# EAGLE design rc4 (EAGLE 9.6.2)
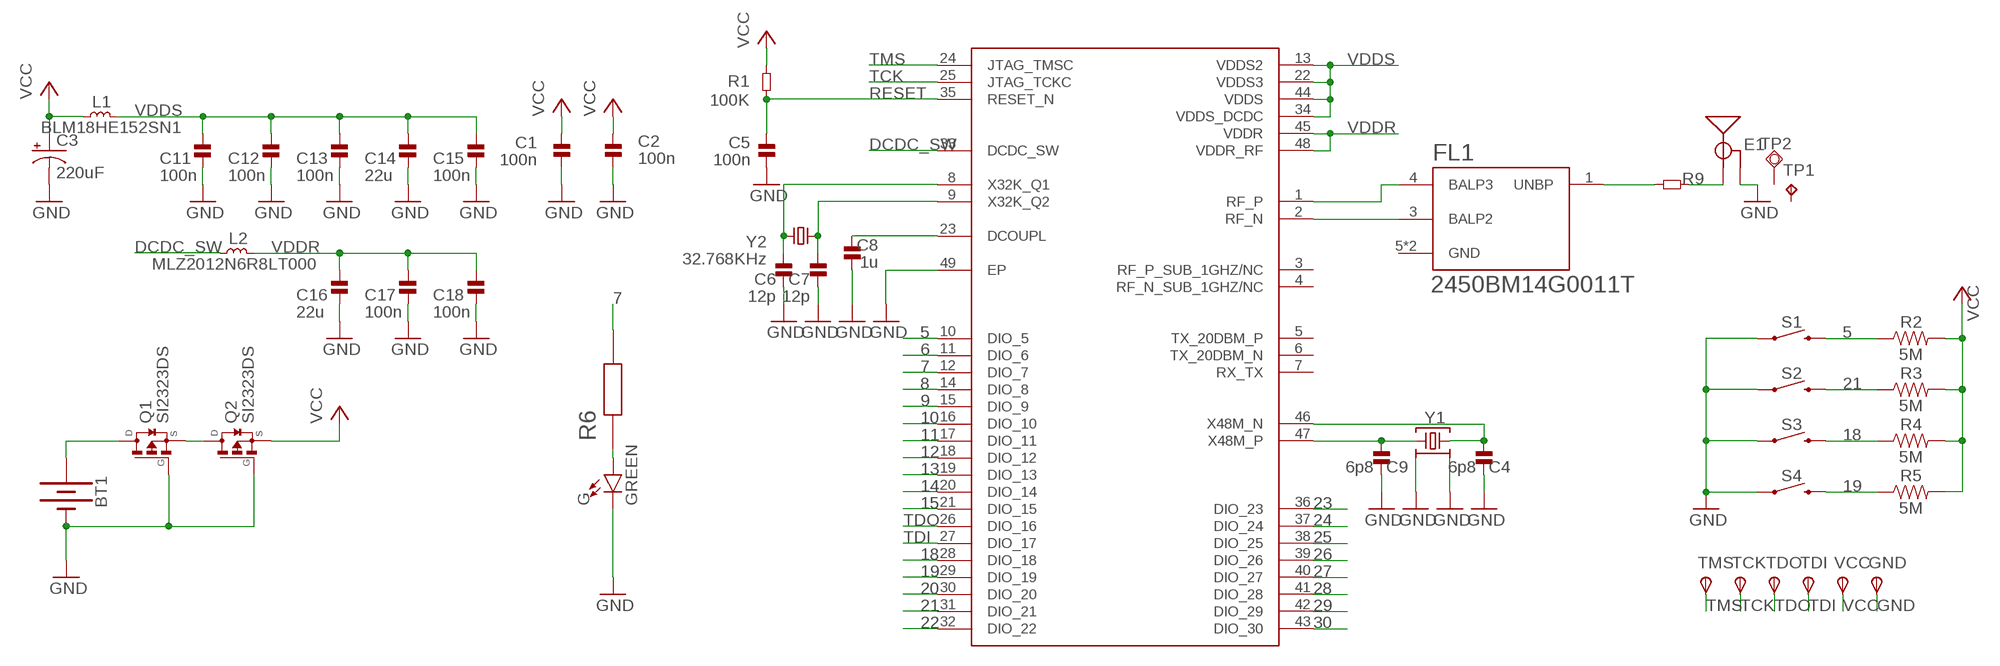
[diagram p0: schematic, sheet 1]

## Parts
BT1  BATTERY-20MM_SMD_4LEGS_OVERPASTE  [BATTCON_20MM_4LEGS_OVERPASTE]
C1  100n  CAP-0402  [_PKG_C_0402]
C2  100n  CAP-0402  [_PKG_C_0402]
C3  220uF  47UF-POLAR-EIA3528-10V-10%  [EIA3528]
C4  6p8  CAP-0402  [_PKG_C_0402]
C5  100n  CAP-0402  [_PKG_C_0402]
C6  12p  CAP-0402  [_PKG_C_0402]
C7  12p  CAP-0402  [_PKG_C_0402]
C8  1u  CAP-0402  [_PKG_C_0402]
C9  6p8  CAP-0402  [_PKG_C_0402]
C11  100n  CAP-0402  [_PKG_C_0402]
C12  100n  CAP-0402  [_PKG_C_0402]
C13  100n  CAP-0402  [_PKG_C_0402]
C14  22u  CAP-0805  [_PKG_C_0805]
C15  100n  CAP-0402  [_PKG_C_0402]
C16  22u  CAP-0805  [_PKG_C_0805]
C17  100n  CAP-0402  [_PKG_C_0402]
C18  100n  CAP-0402  [_PKG_C_0402]
E1  ANTENNA-GROUNDEDTRACE-15.2MM  [TRACE_ANTENNA_2.4GHZ_15.2MM]
FL1  2450BM14G0011T  [BALUN_2450BM14G0011T]
G  GREEN  LED-GREEN0603  [LED-0603]
GND  TPSTP11R  [TP11R]
IC3  CC2652R1FRGZ  CC2652P1FRGZRRGZ0048A-IPC_B  [RGZ0048A-IPC_B]
L1  BLM18HE152SN1  INDUCTOR-0603  [_PKG_L_0603]
L2  MLZ2012N6R8LT000  INDUCTOR-0805  [_PKG_C_0805]
Q1  SI2323DS  [SOT23]
Q2  SI2323DS  [SOT23]
R1  100K  RES-0402  [_PKG_C_0402]
R2  5M  2.49KOHM-0603-1/10W-1%  [0603]
R3  5M  2.49KOHM-0603-1/10W-1%  [0603]
R4  5M  2.49KOHM-0603-1/10W-1%  [0603]
R5  5M  2.49KOHM-0603-1/10W-1%  [0603]
R6  2.2k  RES0402  [RESC1005X40N]
R9  0  RES-0402  [_PKG_C_0402]
S1  MOMENTARY-SWITCH-SPST-SMD-5.2MM  [TACTILE_SWITCH_SMD_5.2MM]
S2  MOMENTARY-SWITCH-SPST-SMD-5.2MM  [TACTILE_SWITCH_SMD_5.2MM]
S3  MOMENTARY-SWITCH-SPST-SMD-5.2MM  [TACTILE_SWITCH_SMD_5.2MM]
S4  MOMENTARY-SWITCH-SPST-SMD-5.2MM  [TACTILE_SWITCH_SMD_5.2MM]
TCK  TPSTP11R  [TP11R]
TDI  TPSTP11R  [TP11R]
TDO  TPSTP11R  [TP11R]
TMS  TPSTP11R  [TP11R]
TP1  TPTP06SQ  [TP05SQ]
TP2  TPSQTP15SQ  [TP15SQ]
VCC  TPSTP11R  [TP11R]
Y1  Q22FA12800150  48.000MHZ_CX2016DB48000C0FPLC1  [XTAL-4P-2016]
Y2  32.768KHz  32.768KHZ_Q13FC1350000400  [XTAL-2P-3215]

## Nets
5: IC3.10(DIO_5) R2.1 S1.3
6: IC3.11(DIO_6)
7: IC3.12(DIO_7) R6.2
8: IC3.14(DIO_8)
9: IC3.15(DIO_9)
10: IC3.16(DIO_10)
11: IC3.17(DIO_11)
12: IC3.18(DIO_12)
13: IC3.19(DIO_13)
14: IC3.20(DIO_14)
15: IC3.21(DIO_15)
18: IC3.28(DIO_18) R4.1 S3.3
19: IC3.29(DIO_19) R5.1 S4.3
20: IC3.30(DIO_20)
21: IC3.31(DIO_21) R3.1 S2.3
22: IC3.32(DIO_22)
23: IC3.36(DIO_23)
24: IC3.37(DIO_24)
25: IC3.38(DIO_25)
26: IC3.39(DIO_26)
27: IC3.40(DIO_27)
28: IC3.41(DIO_28)
29: IC3.42(DIO_29)
30: IC3.43(DIO_30)
DCDC_SW: IC3.33(DCDC_SW) L2.1
DCOUPL: C8.2 IC3.23(DCOUPL)
GND: BT1.2(-) C1.1 C2.1 C3.C(-) C4.1 C5.1 C6.1 C7.1 C8.1 C9.1 C11.2 C12.2 C13.2 C14.2 C15.2 C16.2 C17.2 C18.2 E1.GND G.C GND.TP(PP) IC3.49(EP) Q1.1(G) Q2.1(G) S1.1 S2.1 S3.1 S4.1 Y1.2 Y1.4
N$1: FL1.4(BALP3) IC3.1(RF_P)
N$2: FL1.3(BALP2) IC3.2(RF_N)
N$3: FL1.1(UNBP) R9.2
N$4: C4.2 IC3.46(X48M_N) Y1.3
N$5: E1.ANT(SIGNAL) R9.1
N$6: BT1.1(+) Q1.3(D)
N$11: G.A R6.1
N$15: Q1.2(S) Q2.3(D)
N$21: C9.2 IC3.47(X48M_P) Y1.1
RESET: C5.2 IC3.35(RESET_N) R1.1
TCK: IC3.25(JTAG_TCKC) TCK.TP(PP)
TDI: IC3.27(DIO_17) TDI.TP(PP)
TDO: IC3.26(DIO_16) TDO.TP(PP)
TMS: IC3.24(JTAG_TMSC) TMS.TP(PP)
VCC: C1.2 C2.2 C3.A(+) L1.1 Q2.2(S) R1.2 R2.2 R3.2 R4.2 R5.2 VCC.TP(PP)
VDDR: C16.1 C17.1 C18.1 IC3.45(VDDR) IC3.48(VDDR_RF) L2.2
VDDS: C11.1 C12.1 C13.1 C14.1 C15.1 IC3.13(VDDS2) IC3.22(VDDS3) IC3.34(VDDS_DCDC) IC3.44(VDDS) L1.2
X32K_Q1: C6.2 IC3.8(X32K_Q1) Y2.1
X32K_Q2: C7.2 IC3.9(X32K_Q2) Y2.2
Unconnected: IC3.3(RF_P_SUB_1GHZ/NC) IC3.4(RF_N_SUB_1GHZ/NC) IC3.5(TX_20DBM_P) IC3.6(TX_20DBM_N) IC3.7(RX_TX) TP1.TP TP2.TP

## Power pins joined to a net without a drawn wire
GND: FL1.5(GND) FL1.6(GND)

## Library data of the parts
BT1 = Batteries:BATTERY: Battery - Single Cell A variety of battery chemistries, sizes, and footprints. Device List: 20MM_PTH - Coin Cell Battery Holder - 20mm (PTH) <https://www.sparkfun.com/products/783> 6.8MM_PTH - Coin Cell Battery Holder - 6.8MM(SMD) <https://www.digikey.com/product-detail/en/seiko-instruments/MS621FE-FL11E/728-1057-ND/1889208?WT.srch=1&gclid=CNOQ5a6LzdQCFZS2wAodXCkE0g> 12MM_SMD - Coin Cell Battery Holder - 12mm (SMD) <https://www.sparkfun.com/products/10592> 12MM_PTH - Coin Cell Battery Holder - 12mm (PTH) <https://www.sparkfun.com/products/7948> 20MM_SMD - 20mm Coin Cell Battery Holder (SMD) (2 legs) Used on the Big Time Watch Kit <https://www.sparkfun.com/products/11734> 20MM_SMD_4LEGS - Coin Cell Battery Holder - 20mm (SMD) <https://www.sparkfun.com/products/11892> 20MM_SMD_4LEGS_OVERPASTE - Coin Cell Battery Holder - 20mm (SMD) <https://www.sparkfun.com/products/11892> (Over-paste on the legs) 24.5MM_PTH - Coin Cell Battery Holder - 24.5mm (PTH) <https://www.sparkfun.com/products/8863> 9V - 9V Battery Holder - PC Mount Used on the SparkFun SparkPunk Sound Kit <https://www.sparkfun.com/products/11177> and SparkFun SparkPunk Sequencer Kit <https://www.sparkfun.com/products/12707> 18650 - Battery Holder - 18650 (PTH) <https://www.sparkfun.com/products/13113> AA - Battery Holder - 1xAA (PTH) <https://www.sparkfun.com/products/7949> AAA - Battery Holder - 1xAAA (PTH) <https://www.sparkfun.com/products/12718> AA_KIT - Battery Holder - 1xAA (PTH) <https://www.sparkfun.com/products/7949> Special kit package - pads only have exposed copper on one side of the board. AAA_KIT - Battery Holder - 1xAAA (PTH) <https://www.sparkfun.com/products/12718> Special kit package - pads only have exposed copper on one side of the board.; PROD_ID: PRT-11892; SF_SKU: BATT-10373
C1 C2 C4-C9 C11-C18 = ok-discretes-dev:CAP
C3 = SparkFun-Capacitors:47UF-POLAR: 47µF polarized capacitors A capacitor is a passive two-terminal electrical component used to store electrical energy temporarily in an electric field.; PROD_ID: CAP-08310; VALUE: 47uF
E1 = SparkFun-RF2:ANTENNA-GROUNDED: Antenna w/ Ground Connection 2.4GHz antennae with signal and ground terminals. TRACE_ANTENNA_2.4GHZ_15.2MM - Meander Trace antenna 15.2 x 5.7mm footprint Based on layout from TI app note AN043 <http://www.ti.com/lit/an/swra117d/swra117d.pdf>. TRACE_ANTENNA_2.4GHZ_25.7MM - Inverted F trace antenna 25.7 x 7.5 mm footprint. Based on layout from TI design note DN0007 <http://www.ti.com/lit/an/swru120b/swru120b.pdf>.
FL1 = 2450BM14G0011T:2450BM14G0011T: BALUN-BPF TI CC2640 CC2650 MATCH Check availability <https://pricing.snapeda.com/parts/2450BM14G0011T/Johanson%20Technology/view-part?ref=eda>; AVAILABILITY: In Stock; DESCRIPTION: RF Balun 2.4GHz ~ 2.5GHz 50 / -Ohm 0603 (1608 Metric), 6 PC Pad; MF: Johanson Technology; MP: 2450BM14G0011T; PACKAGE: 0603 Johanson; PRICE: None; PURCHASE-URL: https://pricing.snapeda.com/search/part/2450BM14G0011T/?ref=eda
G = SparkFun-LED:LED-GREEN: Green SMD LED Used in manufacturing of various products at SparkFun Packages: 0603 - SMD 0603 package [Product Link] <http://www.futureelectronics.com/en/technologies/semiconductors/optoelectronics/leds/Pages/9894312-LTST-C190GKT.aspx?CrossPart=HSMG-C190&IM=0> LilyPad 1206 - SMD1206 LilyPad package [Product Link] <http://www.futureelectronics.com/en/Technologies/Product.aspx?ProductID=IN150NGHARVATEKCORPORATION2049943&IM=0> 1206 - SMD1206 package [Product Link] <http://www.futureelectronics.com/en/technologies/semiconductors/optoelectronics/leds/Pages/8315665-LTST-C150KGKT.aspx?IM=0> 1206 Bottom Mount -SMD 1206 Bottom Mount [Product Link] <http://www.digikey.com/product-detail/en/lite-on-inc/LTST-C230KGKT/160-1456-1-ND/386854> SparkFun Products: Pro Mini 328 -5V <https://www.sparkfun.com/products/821> RedBoard <https://www.sparkfun.com/products/12757> MP3 Trigger <https://www.sparkfun.com/products/13720> Makey Makey <https://www.sparkfun.com/products/11076>; PROD_ID: DIO-00821
GND TCK TDI TDO TMS VCC = testpad:TPS: TEST PIN
IC3 = CC2652P1FRGZR:CC2652P1FRGZR; COPYRIGHT: Copyright (C) 2022 Ultra Librarian. All rights reserved.; MANUFACTURER_PART_NUMBER: CC2652P1FRGZR; MFR_NAME: Texas Instruments; REFDES: RefDes; TYPE: TYPE
L1 L2 = ok-discretes-dev:INDUCTOR
Q1 Q2 = SI2323DS:SI2323DS: P-Channel MOSFET; AVAILABILITY: Unavailable; DESCRIPTION: P-Channel 20V 3.7A (Ta) 750mW (Ta) Surface Mount SOT-23-3 (TO-236); MF: Vishay Siliconix; MP: SI2323DS; PACKAGE: SOT-23-3 Vishay Siliconix; PRICE: None
R1 R9 = ok-discretes-dev:RES
R2-R5 = SparkFun-Resistors:2.49KOHM: 2.49kΩ resistor A resistor is a passive two-terminal electrical component that implements electrical resistance as a circuit element. Resistors act to reduce current flow, and, at the same time, act to lower voltage levels within circuits. - Wikipedia; PROD_ID: RES-09568; VALUE: 2.49k
R6 = discretes-dev:RES0402: RESISTOR, 0402 0.063W 1% 3M6; Resistance:3.6Mohm; Resistance Tolerance:± 1%; Power Rating:0.063W; Voltage Rating:50V; Series:RC32H; Temperature Coefficient:± 100ppm/°C; Resistor Element Type:Thick Film; Resistor Case Style:0402; No. of Pins:2; SVHC:No SVHC; Case Style:0402; External Length / Height:1mm; Temperature Coeff. +:100ppm/°C; Temperature Coeff. -:100ppm/°C; External Depth:0.35mm; External Width:0.5mm; Operating Temperature Range:-55°C to +155°C; Overload Voltage:100V Check prices <https://pricing.snapeda.com/parts/RC0402FR-073M6L/Yageo/view-part?ref=eda>; AVAILABILITY: Good; DESCRIPTION: RESISTOR, 0402 0.063W 1% 3M6; Resistance:3.6Mohm; Resistance Tolerance:± 1%; Power Rating:0.063W; Voltage Rating:50V; Series:RC32H; Temperature Coefficient:± 100ppm/°C; Resistor Element Type:Thick Film; Resistor Case Style:0402; No. of Pins:2; SVHC:No SVHC; Case Style:0402; External Length / Height:1mm; Temperature Coeff. +:100ppm/°C; Temperature Coeff. -:100ppm/°C; External Depth:0.35mm; External Width:0.5mm; Operating Temperature Range:-55°C to +155°C; Overload Voltage:100V; MF: Yageo; MP: RC0402FR-073M6L; PACKAGE: 1005 Panasonic Electronic Components; PRICE: None; PURCHASE-URL: https://pricing.snapeda.com/search/part/RC0402FR-073M6L/?ref=eda
S1-S4 = SparkFun-Switches:MOMENTARY-SWITCH-SPST: Momentary Switch (Pushbutton) - SPST Normally-open (NO) SPST momentary switches (buttons, pushbuttons). Variants PTH-12MM - 12mm square, through-hole Momentary Pushbutton Switch - 12mm Square <https://www.sparkfun.com/products/9190> (COM-09190) PTH-6.0MM, PTH-6.0MM-KIT - 6.0mm square, through-hole Mini Pushbutton Switch <https://www.sparkfun.com/products/97> (COM-00097) KIT package intended for soldering kit's - only one side of pads' copper is exposed. PTH-RIGHT-ANGLE-KIT - Right-angle, through-hole Right Angle Tactile Button <https://www.sparkfun.com/products/10791> - Used on SparkFun BigTime Watch Kit <https://www.sparkfun.com/products/11734> SMD-12MM - 12mm square, surface-mount Tactile Button - SMD (12mm) <https://www.sparkfun.com/products/12993> (COM-12993) Used on SparkFun PicoBoard <https://www.sparkfun.com/products/11888> SMD-4.5MM - 4.5mm Square Trackball Switch Used on SparkFun Blackberry Trackballer Breakout <https://www.sparkfun.com/products/13169> SMD-4.6MMX2.8MM - 4.60mm x 2.80mm, surface mount Used on SparkFun SAMD21 Mini Breakout <https://www.sparkfun.com/products/13664> SMD-5.2MM, SMD-5.2-REDUNDANT - 5.2mm square, surface-mount Mini Pushbutton Switch - SMD <https://www.sparkfun.com/products/8720> (COM-08720) Used on Arduino Pro Mini <https://www.sparkfun.com/products/11114> REDUNDANT package connects both switch circuits together SMD-6.0X3.5MM - 6.0 x 3.5mm, surface mount Momentary Reset Switch SMD <https://www.sparkfun.com/products/8229> (COM-08229) SMD-6.2MM-TALL - 6.2mm square, surface mount Tactile Button - SMD (6mm) <https://www.sparkfun.com/products/12992> Used on SparkFun Digital Sandbox <https://www.sparkfun.com/products/12651> SMD-RIGHT-ANGLE - Right-angle, surface mount Used on SparkFun Block for Intel® Edison - Arduino <https://www.sparkfun.com/products/13036>; PROD_ID: SWCH-08247; SF_SKU: COM-08720
TP1 = testpad:TP: Test pad
TP2 = testpad:TPSQ: Test pad
Y1 = ok-xtal-osc-dev:48.000MHZ_CX2016DB48000C0FPLC1: 48MHz ±10ppm Crystal 7pF 50 Ohms 4-SMD, No Lead Datasheet <https://media.digikey.com/pdf/Data%20Sheets/Kyocera%20International/CX2016DB48000C0FPLC1_DS.pdf>; DIGIKEY_PART: 1253-2042-1-ND; MFG_NAME: KYOCERA; MFG_PART: CX2016DB48000C0FPLC1
Y2 = ok-xtal-osc-dev:32.768KHZ_Q13FC1350000400: SMD Crystal Resonators 32.768KHz +/-20ppm SMD-3215_2P RoHS Datasheet <https://datasheet.lcsc.com/szlcsc/1901081604_Seiko-Epson-Q13FC1350000400_C32346.pdf>; LCSC_PART: C32346; MFG_NAME: SEIKO EPSON; MFG_PART: Q13FC1350000400

## Board
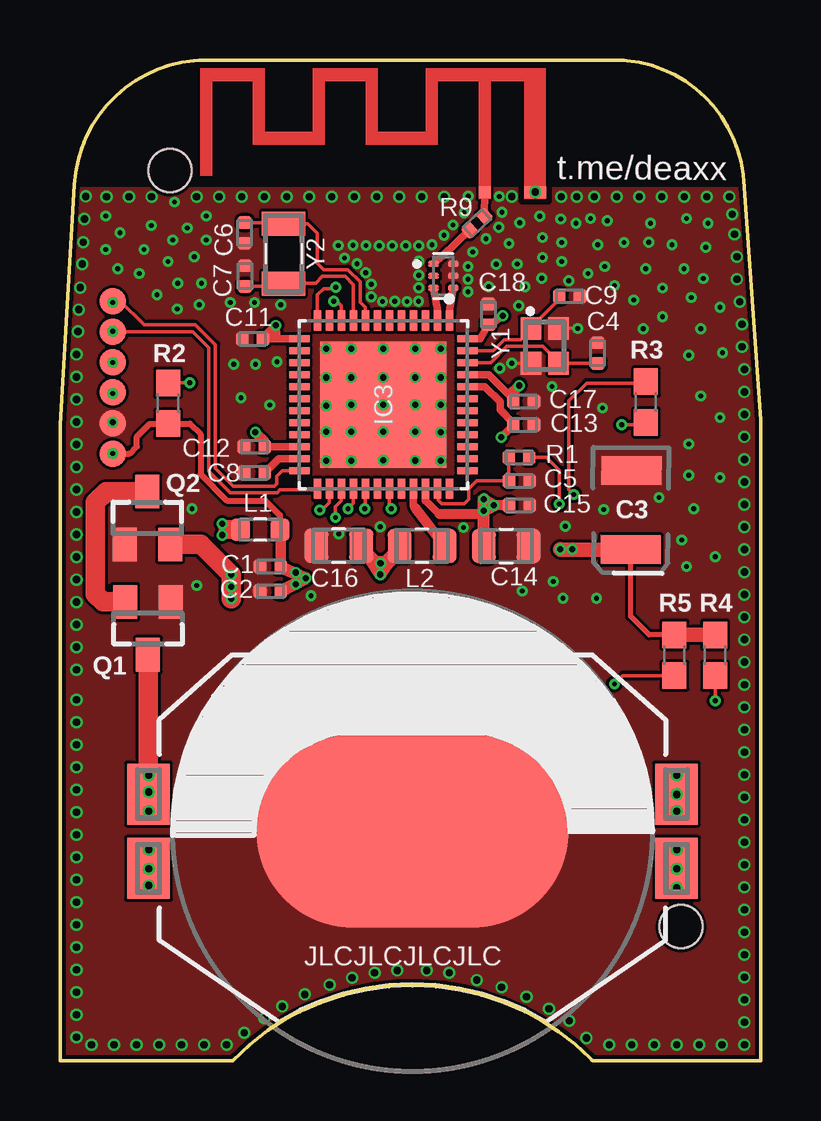
[diagram p1: board, top side]
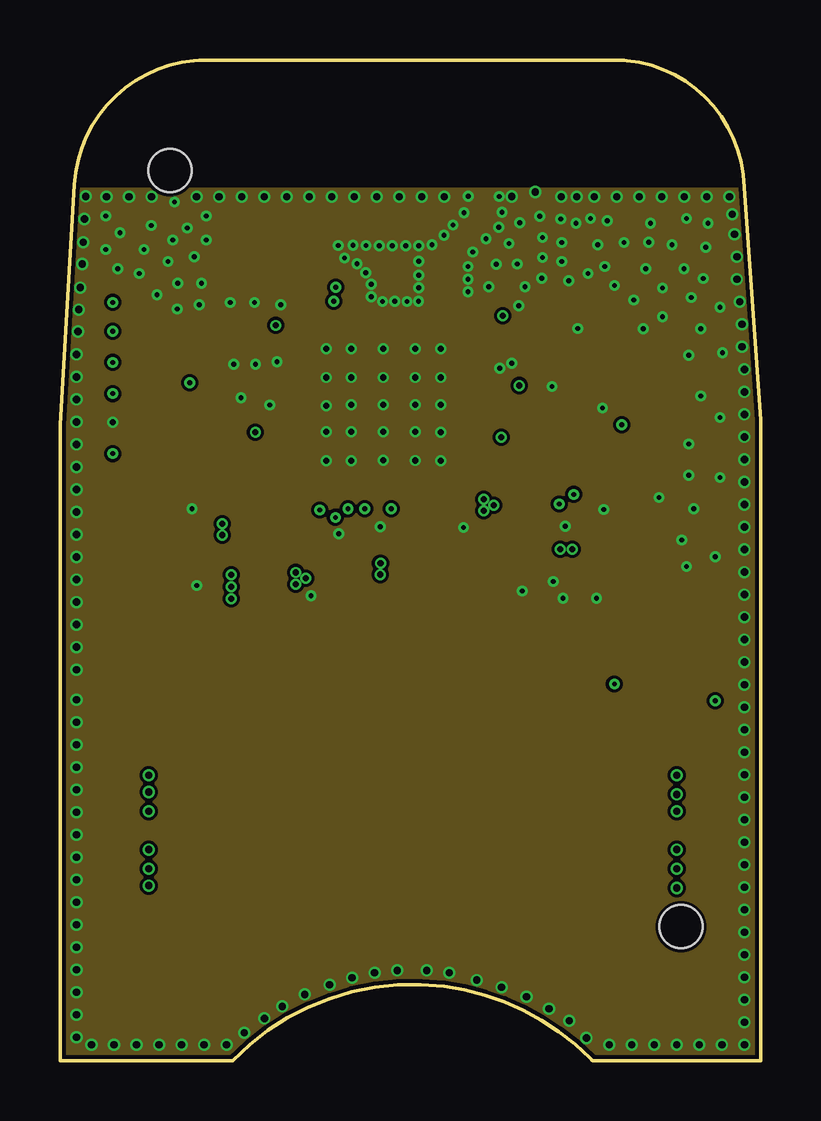
[diagram p2: board, inner layer Route2]
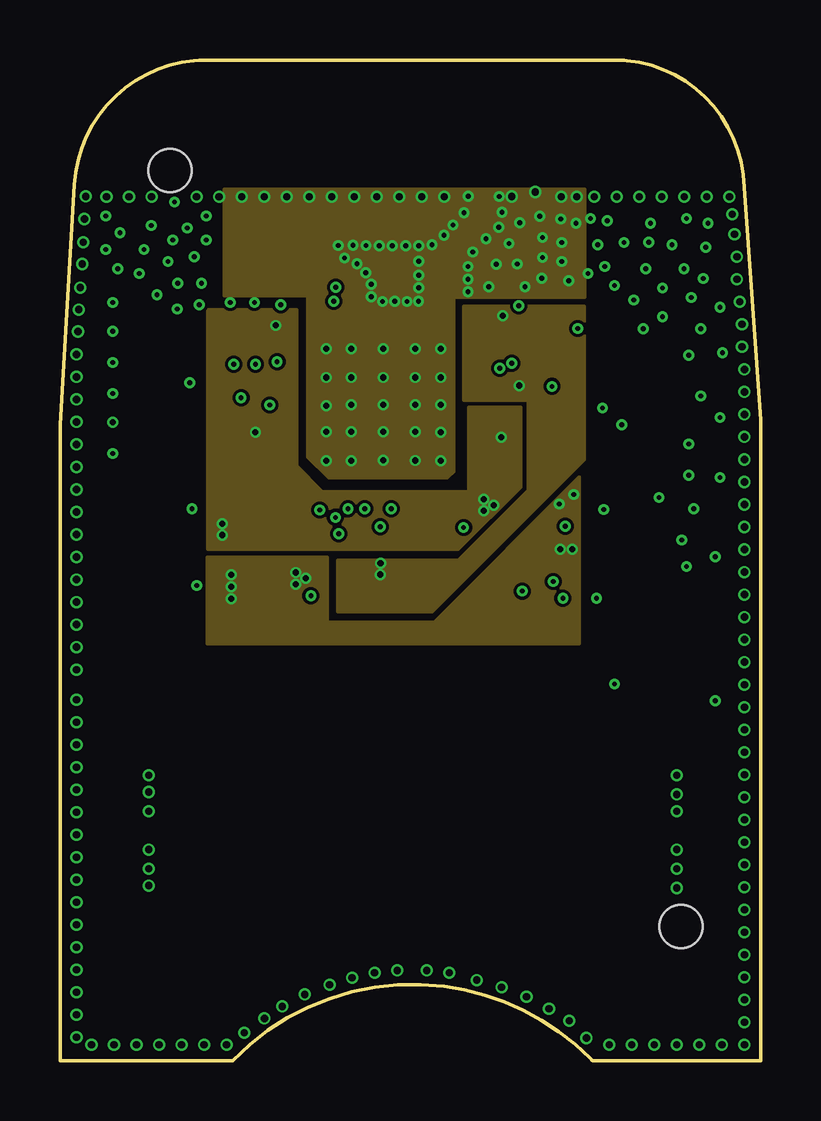
[diagram p3: board, inner layer Route15]
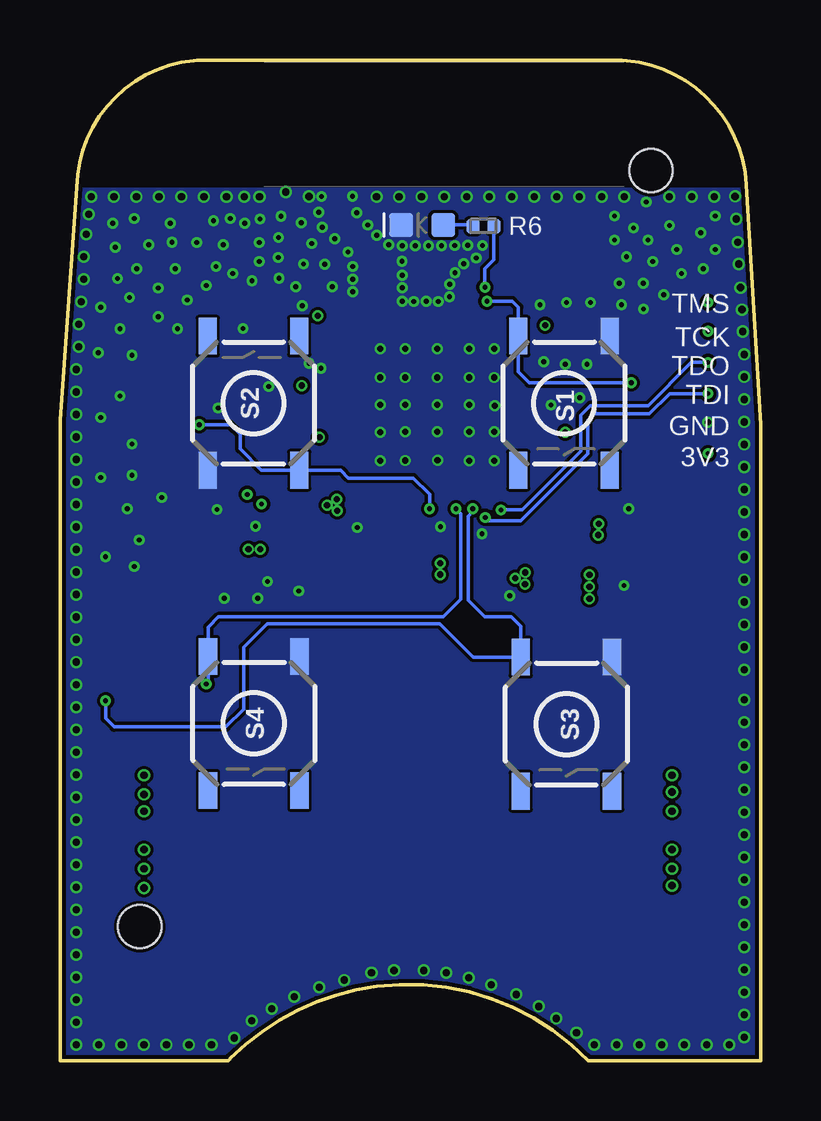
[diagram p4: board, bottom side, seen from below]

Size 29.2 x 41.7 mm. Coordinates in mm from the lower left corner, seen from the top.
Outline: 6.1,41.7 23.1,41.7
Outline: 23.1,41.7 23.5,41.7
Outline: 6.1,41.7 5.8,41.7
Outline: 6.1,41.7 arc87 0.6,36.5 0,26.5 0,0 7.2,0 arc-53 16,3.1 arc-38 22.1,0.1 arc0 22.2,0 29.2,0 29.2,26.7 28.5,36.4 arc89 23.1,41.7
Copper layers (1*2*15*16): Top 0.035559375mm / dielectric 0.17018125mm / Route2 0.01778125mm / dielectric 0.4mm / Route15 0.01778125mm / dielectric 0.17018125mm / Bottom 0.035559375mm
Design rules "oshpark-4layer *": minimum track width 6mil, minimum drill 0.2mm, track to track 5mil, track to pad 5mil, pad to pad 5mil, via to via 5mil, smd to smd 5mil, copper to edge 0.16mm, drill to drill 0.2mm, minimum pad ring 4mil, minimum via ring 4mil, stop-mask expansion 2mil, vias tented up to drill 50mil, thermal gap 10mil
Holes 1.8 mm at 25.88,5.59 4.58,37.09
tRestrict: area 8.5,32.9 to 10.2,34.4; 3 lines

### Footprints (pad centres in the part's own frame; a part is rotated, then mirrored left to right if it is on the bottom)
BATTCON_20MM_4LEGS_OVERPASTE = smd 1.778 x 2.54: 1 -11,1.55; 3 11,1.55; P$1 -11,-1.55; P$2 11,-1.55 | smd 13 x 8: 2 0,0
_PKG_C_0402 = smd 0.54 x 0.6: 1 -0.43,0; 2 0.43,0
EIA3528 = smd 1.2 x 2.5: A 1.65,0; C -1.65,0
_PKG_C_0805 = smd 1 x 1.42: 1 -0.935,0; 2 0.935,0
TRACE_ANTENNA_2.4GHZ_15.2MM = smd 0.5 x 0.5: ANT -3.127,-0.25 | smd 0.9 x 0.5: GND -1.027,-0.25
BALUN_2450BM14G0011T = smd 0.45 x 0.25: 1 -0.41,0.5; 2 -0.41,0; 3 -0.41,-0.5; 4 0.41,-0.5; 5 0.41,0; 6 0.41,0.5
LED-0603 = smd 1 x 1: A -0.877,0; C 0.877,0
TP11R = smd 1.1 x 1.1: TP 0,0
RGZ0048A-IPC_B = smd 0.85 x 0.3: 1 -3.501,2.75; 2 -3.501,2.25; 3 -3.501,1.75; 4 -3.501,1.25; 5 -3.501,0.75; 6 -3.501,0.25; 7 -3.501,-0.25; 8 -3.501,-0.75; 9 -3.501,-1.25; 10 -3.501,-1.75; 11 -3.501,-2.25; 12 -3.501,-2.75; 25 3.501,-2.75; 26 3.501,-2.25; 27 3.501,-1.75; 28 3.501,-1.25; 29 3.501,-0.75; 30 3.501,-0.25; 31 3.501,0.25; 32 3.501,0.75; 33 3.501,1.25; 34 3.501,1.75; 35 3.501,2.25; 36 3.501,2.75 | smd 0.3 x 0.85: 13 -2.75,-3.501; 14 -2.25,-3.501; 15 -1.75,-3.501; 16 -1.25,-3.501; 17 -0.75,-3.501; 18 -0.25,-3.501; 19 0.25,-3.501; 20 0.75,-3.501; 21 1.25,-3.501; 22 1.75,-3.501; 23 2.25,-3.501; 24 2.75,-3.501; 37 2.75,3.501; 38 2.25,3.501; 39 1.75,3.501; 40 1.25,3.501; 41 0.75,3.501; 42 0.25,3.501; 43 -0.25,3.501; 44 -0.75,3.501; 45 -1.25,3.501; 46 -1.75,3.501; 47 -2.25,3.501; 48 -2.75,3.501 | smd 5.25 x 5.25: 49 0,0
_PKG_L_0603 = smd 0.79 x 0.93: 1 -0.82,0; 2 0.82,0
SOT23 = smd 1 x 1.4: 1 -0.95,-1.1; 2 0.95,-1.1; 3 0,1.1
0603 = smd 1.1 x 1: 1 -0.85,0; 2 0.85,0
RESC1005X40N = smd 0.54 x 0.6: 1 -0.432,0; 2 0.432,0
TACTILE_SWITCH_SMD_5.2MM = smd 1.524 x 0.762: 1 -2.794,1.905; 2 2.794,1.905; 3 -2.794,-1.905; 4 2.794,-1.905
TP05SQ = smd 0.5 x 0.5: TP 0,0
TP15SQ = smd 0.5 x 0.9: TP 0,0
XTAL-4P-2016 = smd 0.95 x 0.85: 1 -0.725,-0.575; 2 0.725,-0.575; 3 0.725,0.575; 4 -0.725,0.575
XTAL-2P-3215 = smd 1 x 1.8: 1 -1.25,0; 2 1.25,0

### Placement (x,y rotation side)
BT1  14.69,9.56 0 top
C1  8.76,20.59 0 top
C2  8.76,19.56 0 top
C3  23.8,22.95 269.5 top
C4  22.39,29.49 270 top
C5  19.14,24.16 180 top
C6  7.69,34.49 90 top
C7  7.71,32.7 270 top
C8  8.1,24.5 0 top
C9  21.23,31.86 180 top
C11  8.03,30.08 180 top
C12  8.1,25.58 180 top
C13  19.32,26.5 0 top
C14  18.6,21.45 0 top
C15  19.14,23.15 0 top
C16  11.62,21.46 180 top
C17  19.32,27.46 0 top
C18  17.85,31.1 90 top
E1  20.82,36.44 0 top
FL1  15.97,32.71 0 top
G  14.11,34.83 180 bottom
GND  2.2,26.57 0 top
IC3  13.48,27.34 270 top
L1  8.34,22.13 180 top
L2  15.09,21.45 180 top
Q1  3.66,18.02 180 top
Q2  3.64,22.62 0 top
R1  19.13,25.14 0 top
R2  4.5,27.4 270 top
R3  24.41,27.45 90 top
R4  27.3,16.9 90 top
R5  25.6,16.9 90 top
R6  11.56,34.77 0 bottom
R9  17.37,34.9 223.1 top
S1  8.2,27.4 270 bottom
S2  21.14,27.4 90 bottom
S3  8.1,14.02 270 bottom
S4  21.12,14.06 270 bottom
TCK  2.19,30.38 0 top
TDI  2.2,27.85 0 top
TDO  2.2,29.12 0 top
TMS  2.2,31.65 0 top
TP1  17.69,36.19 0 top
TP2  19.8,36.2 90 top
VCC  2.2,25.3 0 top
Y1  20.2,29.79 270 top
Y2  9.31,33.63 270 top

### Tracks (layer width: path | path; a pad name or v marks a point on that pad's centre or on a via)
5  (via drill 0.2 pad 0.45)
  Top 0.152: IC3.10 11.73,31.46 11.53,31.65 v11.41,31.65 | R2.1 v5.4,28.25
  Bottom 0.152: v11.41,31.65 10.35,31.65 10.1,31.4 S1.3 10.1,28.7 9.65,28.25 v5.4,28.25
7  (via drill 0.2 pad 0.45)
  Top 0.152: IC3.12 10.73,31.91 10.99,32.18 11.44,32.18 v11.5,32.23
  Bottom 0.152: R6.2 11.13,33.37 11.5,33.01 v11.5,32.23
18  (via drill 0.2 pad 0.45)
  Top 0.152: v12,23 12.23,23.23 IC3.28 | R4.1 v27.3,15
  Bottom 0.152: v12,23 12,22.9 12.2,22.7 12.2,19.2 11.5,18.5 10.4,18.5 10,18.1 S3.3 11.98,16.82 13.39,18.22 20.57,18.22 21.55,17.24 21.55,14.65 22.29,13.91 26.94,13.91 27.3,14.27 v27.3,15
19  (via drill 0.2 pad 0.45)
  Top 0.152: IC3.29 12.73,23.03 v12.7,23 | R5.1 23.45,16.05 v23.1,15.7
  Bottom 0.152: v12.7,23 12.5,22.8 12.5,19.24 13.24,18.5 22.6,18.5 23.03,18.07 S4.3 23.03,15.77 v23.1,15.7
21  (via drill 0.2 pad 0.45)
  Top 0.152: IC3.31 13.73,23.07 v13.8,23 | R3.1 24.32,26.5 v23.4,26.5
  Bottom 0.152: v13.8,23 13.8,23.6 14.48,24.28 17.18,24.28 17.5,24.6 S2.3 20.81,24.61 21.7,25.5 21.7,26.1 22.1,26.5 v23.4,26.5
24
  Top 0.152: IC3.37 17.03,24.48
DCDC_SW
  Top 0.305: 14.73,23.88 IC3.33 14.73,23.12 14.82,23.03
  Top 0.406: 16.18,21.61 16.18,21.48 16.16,21.45 L2.1 | L2.1 15.87,21.61 | L2.1 15.92,21.55 15.9,21.55 | L2.1 16.02,21.69 | L2.1 14.82,23.03
DCOUPL
  Top 0.305: IC3.23 9.11,25.09 C8.2
GND  (via drill 0.2 pad 0.45, 0.25 pad 0.46, 0.3)
  Top 0.152: Y1.2 v18.82,29.06 | Y1.4 v21.57,30.52 v21.57,30.51 | v2.2,26.6 GND.TP
  Top 0.254: E1.GND v19.8,36.2
  Top 0.61: 8.32,19.58 C2.1
  other vias: 12.14,28.47 13.48,27.34 12.14,26.2 12.14,27.34 13.48,28.47 14.81,28.47 14.81,27.34 14.81,26.2 13.48,26.2 11.1,26.2 11.09,27.3 11.1,28.47 15.86,26.19 15.86,27.34 15.86,28.47 11.1,25 12.14,25 13.47,25.02 14.81,25.01 15.86,25.01 11.1,29.67 12.14,29.67 13.48,29.67 14.81,29.67 15.86,29.67 1.07,36.02 1.94,36 2.88,36 3.81,36 5.69,36 6.63,36 7.57,36 8.5,36 9.44,36 10.38,36 11.32,36 12.26,36 13.2,36 14.13,36 15.07,36 16.01,36 20.89,36 21.53,36 22.26,36 23.2,36 24.14,36 25.08,36 26.02,36 26.95,36 27.89,36 1.02,35.07 0.96,34.11 0.92,33.2 0.85,32.22 0.78,31.3 0.75,30.39 0.69,29.43 0.69,28.5 0.69,27.56 0.69,26.62 0.69,25.68 0.69,24.74 0.69,23.8 0.69,22.87 0.69,21.93 0.69,20.99 0.69,18.18 0.69,17.24 0.69,16.3 0.69,9.42 0.69,8.48 0.69,7.54 0.69,6.61 0.69,5.67 0.69,4.73 0.69,3.79 0.69,2.85 0.69,1.92 0.69,0.98 1.31,0.66 2.25,0.66 3.19,0.66 4.13,0.66 5.07,0.66 6,0.66 6.94,0.66 7.68,1.16 8.52,1.76 9.26,2.26 10.19,2.76 11.23,3.16 12.17,3.46 13.11,3.66 14.05,3.76 15.28,3.76 16.22,3.66 17.36,3.36 18.4,3.06 19.44,2.66 20.37,2.16 21.21,1.66 21.94,0.95 22.89,0.66 23.83,0.66 24.77,0.66 25.7,0.66 26.64,0.66 27.58,0.66 28.52,0.66 28.52,1.6 28.52,2.54 28.52,3.48 28.52,4.42 28.52,5.36 28.52,6.29 28.52,7.23 28.52,8.17 28.52,9.11 28.52,10.05 28.52,10.98 28.52,11.92 28.52,12.86 28.52,13.8 28.52,14.74 28.52,15.67 28.52,16.61 28.52,17.55 28.52,18.49 28.52,19.43 28.52,20.36 28.52,21.3 28.52,22.24 28.52,23.18 28.52,24.12 28.52,25.06 28.52,25.99 28.52,26.93 28.52,27.87 28.52,28.81 28.42,29.75 28.42,30.68 28.32,31.62 28.2,32.56 28.2,33.5 28.1,34.44 28,35.27 0.69,10.36 0.69,11.3 0.69,12.23 0.69,13.17 0.69,14.11 0.69,15.05 0.69,20.05 0.69,19.11 14.94,31.64 14.94,32.73 14.94,33.96 15.5,34 16,34.4 16.37,34.82 16.84,35.34 17.01,36.03 17,32.56 17,33.1 17.2,33.7 17.75,34.25 18.28,34.73 18.42,35.35 14.46,31.64 13.94,31.64 13.43,31.64 12.97,32.35 12.97,31.84 12.74,32.84 12.38,33.21 12.21,33.98 12.75,33.97 13.3,33.97 14.4,33.96 2.5,34.5 4.5,33.3 3.3,32.8 6.1,34.2 4.7,34.2 2.4,33 4.9,32.4 23.5,34.1 25.1,32.2 23.1,32.3 25.5,34 27,34.9 24.6,34.9 22.8,35 26.7,30.5 26.8,32.6 25.1,31 27.5,26.8 26.7,27.7 26.2,25.7 27.5,24.3 26.2,24.4 26.4,23 24.96,23.47 22.6,27.2 20.5,28.1 5.5,23 5.7,19.8 3.8,34.8 6.1,35.2 5.3,34.7 1.9,35.2 1.9,33.8 3.5,33.8 5.6,33.5 5.9,32.4 5.8,31.5 24.4,33 22.7,33.1 22.4,34 26.9,33.9 27.5,31.4 26.3,31.8 26.2,29.4 27.6,29.5 26,33 26.1,35.1 24.3,30.5 20.1,34.3 20.87,35.08 20.9,33.3 18.71,34.05 18.17,33.19 20.08,32.61 20,35.2 19.15,34.92 20.9,34.1 19.06,33.2 21.5,34.9 22,32.8 21.2,32.5 22.1,35.1 23.9,31.7 27.3,21 26.1,20.6 25.9,21.7 4.04,31.92 4.89,31.33 18.82,36.01 18.31,36.01 24.54,34.11 20.11,33.47 4.77,35.79 7.24,29.02 9.04,29.12 8.74,27.32 8.14,29.02 7.54,27.62 19.37,32.26 7.1,31.6 8.1,31.6 9.2,31.5 13.85,33.97 14.95,33.31 17,32.05 17.86,32.25 18.32,28.86 20.56,19.97 21.06,22.27 19.26,19.57 20.96,19.27 22.36,19.27 22.66,22.97 10.46,19.37 11.62,21.96 11.86,33.45 11.6,33.97 14.94,32.21 16.82,22.22 13.35,22.25 19.11,31.46
  pour Top (no thermals): -0.31,-0.82 29.87,-0.82 29.87,36.33 -0.31,36.33
  pour Route15: 11.19,24.29 16.14,24.29 16.4,24.54 16.4,31.8 21.86,31.8 21.86,36.32 6.83,36.32 6.83,31.87 10.33,31.87 10.33,25.15
  pour Route2: -0.63,36.32 -0.63,-0.52 29.59,-0.52 29.59,36.32
  pour Bottom (no thermals): -0.91,-0.33 30.11,-0.33 30.11,36.32 -0.91,36.32
N$1
  Top 0.305: IC3.1 16.23,31.35 FL1.4
N$2
  Top 0.305: IC3.2 15.73,31.35 FL1.3
N$3
  Top 0.305: R9.2 15.94,33.55 FL1.1
N$4
  Top 0.152: IC3.46 17.94,29.09 18.62,29.77 20.11,29.77 20.77,29.1 Y1.3 C4.2
N$5
  Top 0.305: 17.7,36.18 E1.ANT R9.1
N$6  (via drill 0.3)
  Top 0.406: 3.69,11.9 BT1.1 3.69,11.19 v3.7,11.2 | v3.7,11.2 v3.7,11.9 | v3.7,10.4 v3.7,11.2
  Top 0.813: Q1.3 3.69,16.89 3.69,11.9
N$7  (via drill 0.3)
  other vias: 3.7,8.8
N$8  (via drill 0.3)
  other vias: 3.7,8
N$9  (via drill 0.3)
  other vias: 3.7,7.3
N$10  (via drill 0.3)
  other vias: 25.7,11.9
N$11
  Bottom 0.152: 13.19,34.78 G.A 12.04,34.83 R6.1
N$12  (via drill 0.3)
  other vias: 25.7,10.4
N$13  (via drill 0.3)
  other vias: 25.7,11.1
N$14  (via drill 0.3)
  other vias: 25.7,8.8
N$15
  Top 0.813: Q1.2 1.79,19.12 1.47,19.44 1.47,23.27 1.92,23.72 Q2.3
N$16  (via drill 0.3)
  other vias: 25.7,8
N$17  (via drill 0.3)
  other vias: 25.7,7.2
N$21
  Top 0.152: IC3.47 18.05,29.59 18.51,30.05 19.2,30.05 19.62,30.47 Y1.1 19.62,30.55 20.8,31.73 C9.2
RESET
  Top 0.152: IC3.35 15.75,23.86 15.75,23.36 15.91,23.2 16.83,23.2 17.03,23.39 17.03,23.84 17.36,24.18 18.7,24.18 | C5.2 18.7,24.18 | 18.7,24.18 R1.1
TCK  (via drill 0.2 pad 0.45)
  Top 0.152: IC3.25 10.63,23.79 9.17,23.79 9.04,23.67 7.09,23.67 6.19,24.57 6.19,29.72 5.53,30.38 TCK.TP v2.19,30.39 v2.2,30.4
TDI  (via drill 0.2 pad 0.45)
  Top 0.152: TDI.TP v2.2,27.8 | v11.48,22.64 11.48,23.08 11.73,23.33 IC3.27
  Bottom 0.152: v11.48,22.64 11.35,22.51 9.99,22.51 7.22,25.28 7.22,26.7 6.96,26.96 | 6.96,26.96 6.9,27.02 | 6.96,26.96 4.64,26.96 3.8,27.8 v2.2,27.8
TDO  (via drill 0.2 pad 0.45)
  Top 0.152: v2.2,29.1 TDO.TP | IC3.26 11.23,23.24 10.93,22.95 v10.82,22.95
  Bottom 0.152: v10.82,22.95 9.95,22.95 7.5,25.4 7.5,26.9 7.1,27.3 4.7,27.3 2.9,29.1 v2.2,29.1
TMS  (via drill 0.2 pad 0.45)
  Top 0.152: IC3.24 9.27,24.59 9.03,24.35 9.03,24.05 8.93,23.95 7.21,23.95 6.47,24.69 6.47,29.84 5.64,30.66 3.51,30.66 2.52,31.65 TMS.TP v2.2,31.6
VCC  (via drill 0.2 pad 0.45, 0.25 pad 0.46)
  Top 0.152: R1.2 20.26,25.14 20.8,24.6 v20.8,23.2 | R2.2 4.51,26.54 4.6,26.45 | R3.2 24.36,28.24 21.94,28.24 21.2,27.5 21.2,23.8 v21.4,23.6 | VCC.TP 2.3,25.4
  Top 0.203: R5.2 24.55,17.75 23.78,18.52 C3.A
  Top 0.254: VCC.TP 2.9,25.3 3.2,25.6 3.2,26 3.74,26.54 4.51,26.54 | R2.2 5.41,26.55 5.86,26.1 5.86,24.43 6.96,23.34 8.56,23.34 9.16,22.74 L1.1
  Top 0.305: C1.2 v9.82,20.35 | C2.2 v9.83,19.86 | v9.83,19.86 v9.82,20.35 | v9.82,20.35 v10.24,20.11 v9.83,19.86
  Top 0.406: 9.2,22.13 | L1.1 9.2,22.13 | 9.2,22.13 C1.2 9.2,22.13
  Top 0.508: v20.85,21.31 v21.35,21.31 | v21.35,21.31 | v21.35,21.31 C3.A | C1.2 v10.24,20.11 C2.2
  Top 0.61: R4.2 R5.2 | C3.A v20.86,21.3 v20.85,21.31
  Top 0.813: v7.14,20.25 5.87,21.52 Q2.2 | v7.14,20.25 v7.14,19.25 | v7.14,19.75 v7.14,20.25
  other vias: 2.2,25.3
  pour Route15: 6.13,20.97 11.13,20.97 11.13,18.28 15.6,18.28 21.64,24.33 21.64,17.37 6.13,17.37
VDDR  (via drill 0.25, 0.25 pad 0.46)
  Top 0.305: 18.79,27.79 18.79,27.56 C17.1 18.89,27.56 17.87,28.59 IC3.45 | C18.1 | v18.45,31.04 17.93,30.67 C18.1 | IC3.48 17.51,30.09 C18.1
  Top 0.406: L2.2 13.8,21.03 13.95,20.98 v13.35,20.26 v13.36,20.73 | 14.08,21.35 L2.2 | C16.1 13.2,20.81 13.51,20.81 L2.2
  Top 0.432: 18.79,27.79 v19.13,28.14
  Top 0.508: C16.1 v13.35,20.26 14.08,21.35
  pour Route15: 16.82,27.53 19.51,27.53 19.51,23.78 16.59,20.86 11.57,20.86 11.57,18.71 15.52,18.71 21.85,25.04 21.85,31.43 16.82,31.43
VDDS  (via drill 0.25, 0.25 pad 0.45, 0.25 pad 0.46)
  Top 0.152: 7.52,22.15 L1.2
  Top 0.305: 18.69,23.17 C15.1 | v18.39,25.99 18.89,26.49 | C13.1 18.89,26.57 18.34,27.12 18.34,27.45 17.7,28.09 IC3.44 | 9.05,30.09 C11.1 | v8.99,30.64 9.05,30.09 | v6.76,22.37 7,22.13 L1.2 7.3,21.91 v6.76,21.91 v6.76,22.36 v6.76,22.37 | v6.76,22.37 7.3,22.37 7.52,22.15 | 15.24,23.33 15.23,23.45 | 15.24,23.33 15.22,23.34 IC3.34 | 15.24,23.33 15.81,22.78 | IC3.22 C12.1 | IC3.13 9.05,30.09
  Top 0.406: 18.89,26.49 C13.1 | v8.99,30.64 8.99,30.62 C11.1 | C12.1 8.53,25.78 8.15,26.17 v8.15,26.19 | C14.1 17.66,21.65 | 17.66,21.65 | 17.66,21.65 17.66,21.8 | C15.1 v18.07,23.15 | 17.65,23.4 v17.66,23.41 | v17.65,22.92 17.52,22.78 15.81,22.78
  Top 0.508: C15.1 | C14.1 v17.65,22.92 | v17.65,22.92 17.65,23.4 | v17.66,23.41 v18.07,23.15 v17.65,22.92
  pour Route15: 19.19,27.24 19.19,23.9 16.6,21.3 6.16,21.3 6.16,31.29 9.86,31.29 9.86,24.8 10.94,23.72 17.03,23.72 17.03,27.24
X32K_Q1
  Top 0.152: C6.2 9.27,34.93 Y2.1 10.32,34.88 10.73,34.48 10.73,33.23 10.99,32.96 12,32.96 12.51,32.46 12.51,31.61 12.73,31.39 IC3.8
X32K_Q2
  Top 0.152: C7.2 9.2,32.27 Y2.2 9.34,32.41 10.66,32.41 10.94,32.68 11.88,32.68 12.23,32.34 IC3.9

### Text on the board
tNames: t.me/deaxx | JLCJLCJLCJLC
bNames: TMS | TCK | TDO | TDI | GND | 3V3